# Altium schematic sheet protoboard.SchDoc
size A4; SheetNumber: 2; SheetTotal: 7
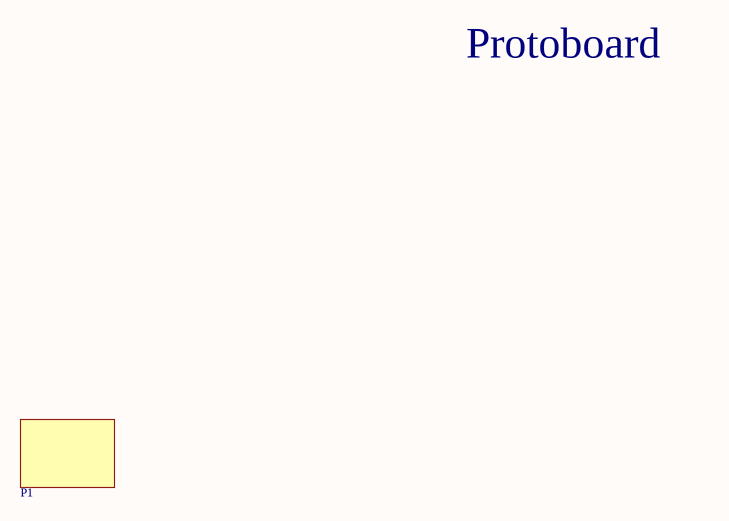
[diagram p0: protoboard.SchDoc]

## Parts
P1  2 protoboard 830 pin  [PCBComponent_1]  (value not drawn)

## Notes on the sheet
- Protoboard

## Library data of the parts
P1 = protoboard: 2 protoboard 830 pin  each; Parameter 1: 2X830 pin